# Altium schematic sheet LCD.SchDoc
size A; DrawnBy: TIMKEN; SheetNumber: 5; SheetTotal: 7
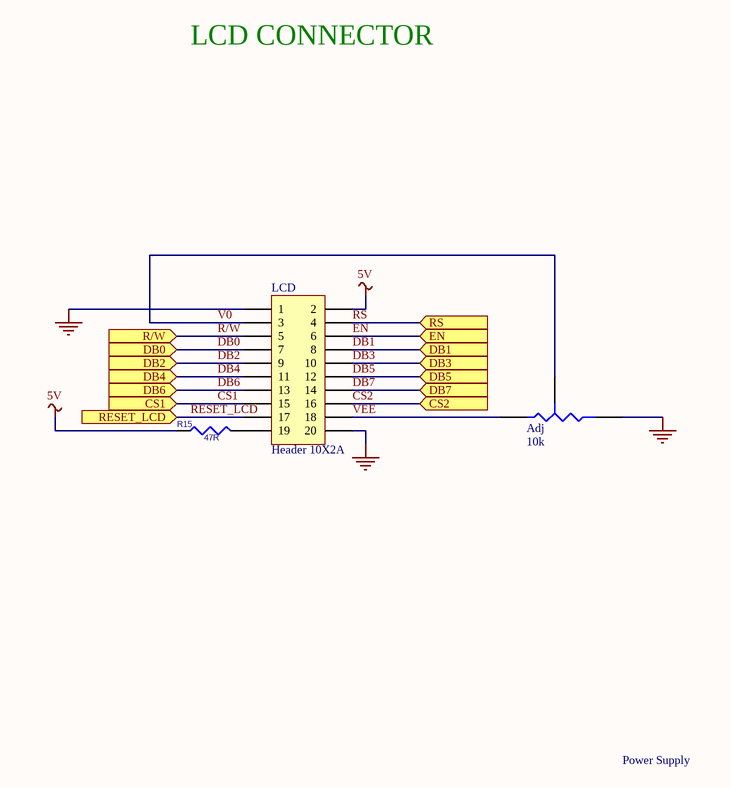
[diagram p0: LCD.SchDoc]

## Parts
Adj  value 10k  [Pot 3pin]  (hidden comment: RES_POT)
LCD  Header 10X2A  [10x2 row_ 2.54mm pitch]
R15  47R  [RES_SMD]

## Ports
CS1 (in), CS2 (in), DB0 (in), DB1 (in), DB2 (in), DB3 (in), DB4 (in), DB5 (in), DB6 (in), DB7 (in), EN (in), R/W (in), RESET_LCD (in), RS (in)

## Nets
5V: LCD.2 R15.1
GND_POWER: Adj.3(B) LCD.1 LCD.20
CS1: LCD.15 ; port CS1
CS2: LCD.16 ; port CS2
DB0: LCD.7 ; port DB0
DB1: LCD.8 ; port DB1
DB2: LCD.9 ; port DB2
DB3: LCD.10 ; port DB3
DB4: LCD.11 ; port DB4
DB5: LCD.12 ; port DB5
DB6: LCD.13 ; port DB6
DB7: LCD.14 ; port DB7
EN: LCD.6 ; port EN
R/W: LCD.5 ; port R/W
RESET_LCD: LCD.17 ; port RESET_LCD
RS: LCD.4 ; port RS
V0: Adj.2(TAP) LCD.3
VEE: Adj.1(A) LCD.18
NetLCD_19: LCD.19 R15.2

## Notes on the sheet
- LCD CONNECTOR
- Power Supply

## Library data of the parts
Adj = RES_POT: Tapped Resistor; Sim Note: Enter the Resistance value and the set point into parameter fields.; Set Position: 0.5; Published: 24-Mar-1999; LatestRevisionDate: 17-Jul-2002; LatestRevisionNote: Re-released for DXP Platform.; PackageReference: VR3; Publisher: Altium Limited; PackageDescription: Variable Resistor, Thru-Hole; 3 Leads
LCD = Header 10x2: Header, 20Pin, Dual row; LatestRevisionDate: 17-Jul-2002; LatestRevisionNote: Re-released for DXP Platform.; Publisher: Altium Limited
R15 = RESISTOR: Vendor: Digikey; Descr: RES 10K OHM 1/2W 5% 0805 SMD; V P No: P10KADTR-ND; M P No: ERJ-P06J103V; FootPrint: 0.079" L x 0.049" W (2.00mm x 1.25mm)  (0805 (2012 Metric)  )